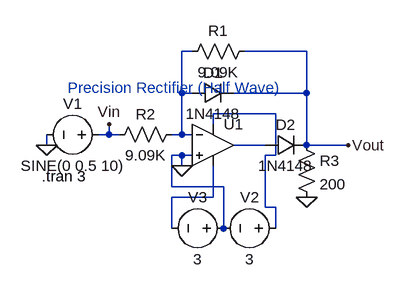
[diagram p0: schematic Precision Rectifier(half wave).asc]
Precision Rectifier(half wave).asc, the LTspice schematic file:
Version 4.1
SHEET 1 880 680
WIRE 144 16 128 16
WIRE 320 16 224 16
WIRE 128 80 128 16
WIRE 144 80 128 80
WIRE 320 80 320 16
WIRE 320 80 208 80
WIRE 272 112 176 112
WIRE 176 128 176 112
WIRE 16 144 16 128
WIRE 16 144 0 144
WIRE 32 144 16 144
WIRE 128 144 128 80
WIRE 128 144 112 144
WIRE 144 144 128 144
WIRE -80 160 -80 144
WIRE 256 160 208 160
WIRE 320 160 320 80
WIRE 384 160 320 160
WIRE 128 176 112 176
WIRE 144 176 128 176
WIRE 272 176 272 112
WIRE 272 176 256 176
WIRE 128 192 128 176
WIRE 112 224 112 176
WIRE 192 224 112 224
WIRE 176 240 176 192
WIRE 176 240 112 240
WIRE 256 256 256 176
WIRE 272 256 256 256
WIRE 112 288 112 240
WIRE 192 288 192 224
WIRE 272 288 272 256
FLAG 128 192 0
FLAG -80 160 0
FLAG 16 128 Vin
FLAG 384 160 Vout
FLAG 320 240 0
SYMBOL OpAmps\\UniversalOpAmp2 176 160 R0
SYMATTR InstName U1
SYMBOL diode 256 176 R270
WINDOW 0 32 32 VTop 2
WINDOW 3 0 32 VBottom 2
SYMATTR InstName D2
SYMATTR Value 1N4148
SYMBOL voltage 16 144 R90
WINDOW 0 -32 56 VBottom 2
WINDOW 3 32 56 VTop 2
WINDOW 123 0 0 Left 0
WINDOW 39 0 0 Left 0
SYMATTR InstName V1
SYMATTR Value SINE(0 0.5 10)
SYMBOL res 240 0 R90
WINDOW 0 0 56 VBottom 2
WINDOW 3 32 56 VTop 2
SYMATTR InstName R1
SYMATTR Value 9.09K
SYMATTR SpiceLine tol=1 pwr=0.1
SYMBOL res 128 128 R90
WINDOW 0 0 56 VBottom 2
WINDOW 3 32 56 VTop 2
SYMATTR InstName R2
SYMATTR Value 9.09K
SYMATTR SpiceLine tol=1 pwr=0.1
SYMBOL res 304 144 R0
SYMATTR InstName R3
SYMATTR Value 200
SYMATTR SpiceLine tol=1 pwr=0.1
SYMBOL voltage 288 288 R90
WINDOW 0 -32 56 VBottom 2
WINDOW 3 32 56 VTop 2
WINDOW 123 0 0 Left 0
WINDOW 39 0 0 Left 0
SYMATTR InstName V2
SYMATTR Value 3
SYMBOL diode 144 96 R270
WINDOW 0 32 32 VTop 2
WINDOW 3 0 32 VBottom 2
SYMATTR InstName D1
SYMATTR Value 1N4148
SYMBOL voltage 208 288 R90
WINDOW 0 -32 56 VBottom 2
WINDOW 3 32 56 VTop 2
WINDOW 123 0 0 Left 0
WINDOW 39 0 0 Left 0
SYMATTR InstName V3
SYMATTR Value 3
TEXT -88 208 Left 2 !.tran 3
TEXT -48 72 Left 2 ;Precision Rectifier (Half Wave)

The netlist it stands for:
* Precision Rectifier(half wave).asc
X§U1 0 N001 N002 N004 N003 level2 Avol=1Meg GBW=10Meg Slew=10Meg Ilimit=25m Rail=0 Vos=0 En=0 Enk=0 In=0 Ink=0 Rin=500Meg  ; pins In+ In- V+ V- OUT
D2 N003 Vout 1N4148
V1 Vin 0 SINE(0 0.5 10)
R1 Vout N001 9.09K tol=1 pwr=0.1
R2 N001 Vin 9.09K tol=1 pwr=0.1
R3 Vout 0 200 tol=1 pwr=0.1
V2 N002 0 3
D1 N001 Vout 1N4148
V3 0 N004 3
.model D D
.lib standard.dio
.tran 3
* Precision Rectifier (Half Wave)
.lib UniversalOpAmp2.lib
.backanno
.end